# Altium schematic sheet TIDA050024.SchDoc (part 2 of 3)
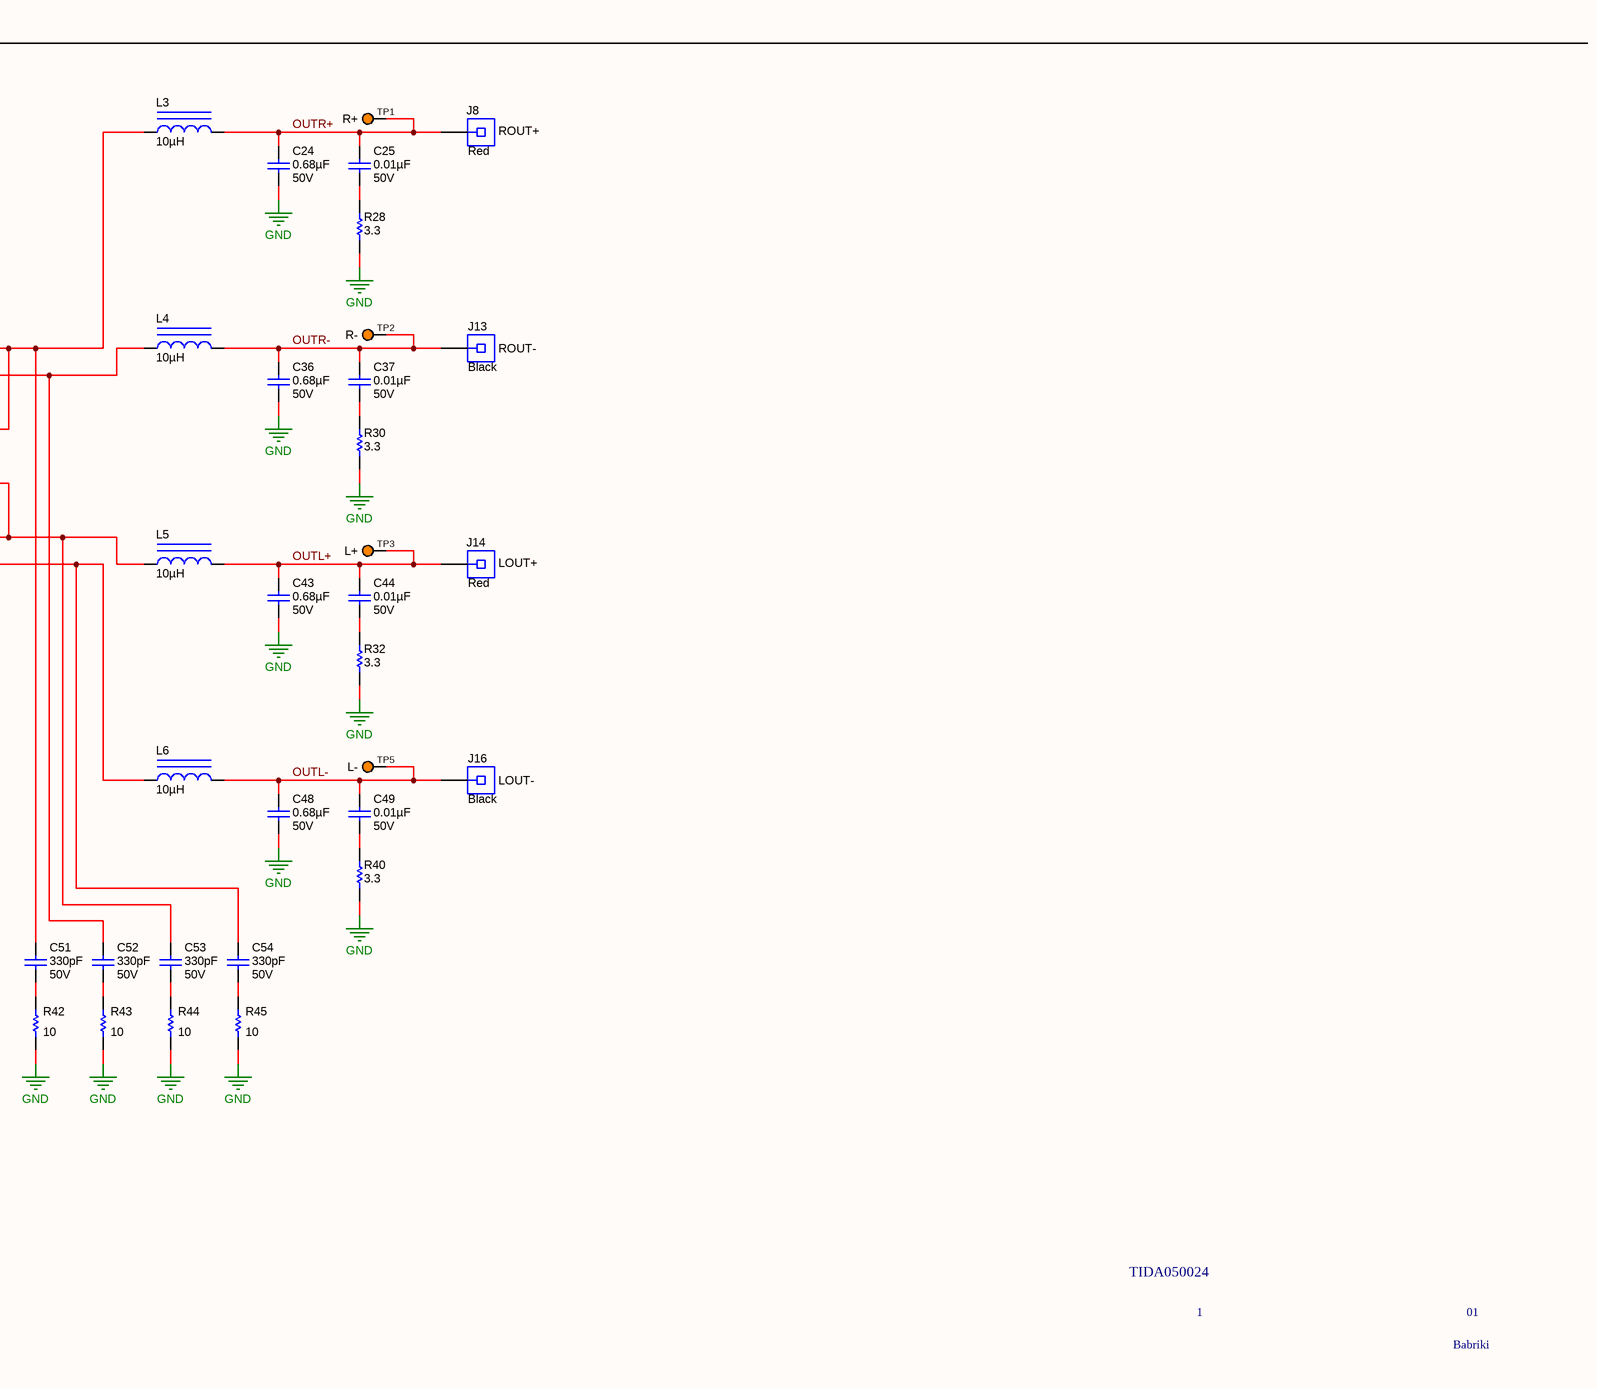
[diagram p5: TIDA050024.SchDoc, bottom right]
## Library data of the parts
C1 C2 C12 C19 C21 C23 = GRM188R61E106MA73D: CAP, CERM, 10 µF, 25 V, +/- 20%, X5R, 0603; Manufacturer: MuRata; Polarized: N; CompType: Capacitor; Value: 10uF; U/M: EA; Cap_F: 0.00001; Tolerance_%: 20; Value1: Unknown; VDC_V: 25; Value2: 25V; TaMin_C: -55; TaMax_C: 85; AEC Category: Q200; SymbolVersion: 2008-07-09; PartNumber: GRM188R61E106MA73D; PackageReference: 0603; RoHS: Y; MountType: SMT; Technology: Ceramic; TempCo: X5R; Cap_Case: 0603; Published: 2008-06-19; Publisher: Texas Instruments; LatestRevisionDate: 2016-04-09; ComponentLink1Description: Datasheet link; ComponentLink1URL: http://psearch.murata.com/capacitor/product/GRM188R61E106MA73%23.pdf; Supplier 1: Digi-Key; Supplier Part Number 1: 490-7202-1-ND; Supplier 2: Mouser; Supplier Part Number 2: 81-GRM188R61E106MA3L; Supplier 3: Farnell; Supplier Part Number 3: 1828803RL; AEC Qualified: ?
C3 = T495D476M025ATE120: CAP, TA, 47 µF, 25 V, +/- 20%, 0.12 ohm, SMD; Manufacturer: Kemet; Polarized: Y; CompType: Capacitor; Value: 47uF; U/M: EA; Cap_F: 0.000047; Tolerance_%: 20; VDC_V: 25; Value2: 25V; ESR_ohm: 0.12; IRMS_A: 1.006; TaMin_C: -55; TaMax_C: 125; Cap_Case: D; AEC Category: Q200; SymbolVersion: 2008-07-09; PartNumber: T495D476M025ATE120; PackageReference: 7343-31; RoHS: Y; Value1: 0.12 ohm; MountType: SMT; Technology: TA; Series: T495; Publisher: Texas Instruments; LatestRevisionDate: 2015-12-04; LatestRevisionNote: Updated supplier links; ComponentLink1Description: Datasheet link; ComponentLink1URL: http://www.kemet.com/kemet/web/homepage/kechome.nsf/file/T495%20Series/$file/F3102_T495.pdf; Supplier 1: Digi-Key; Supplier Part Number 1: 399-4650-1-ND; Supplier 2: Mouser; Supplier Part Number 2: 80-T495D476M025E120; Supplier 3: Farnell; Supplier Part Number 3: 1641490; AEC Qualified: ?
C4 C7-C10 C29 = GRM32ER61E226KE15L: CAP, CERM, 22 µF, 25 V, +/- 10%, X5R, 1210; Manufacturer: MuRata; Polarized: N; CompType: Capacitor; Value: 22uF; U/M: EA; Cap_F: 0.000022; Tolerance_%: 10; ESR_ohm: 0.002; Value1: 0.002 ohm; VDC_V: 25; Value2: 25V; IRMS_A: 3.67; TaMin_C: -55; TaMax_C: 85; Cap_Case: 1210; SizeArea_mm2: 8; SizeAreaWB_mm2: 14.7; SizeX_mm: 3.2; SizeY_mm: 2.5; SizeZ_mm: 2.7; AEC Category: Q200; SymbolVersion: 2008-07-09; PartNumber: GRM32ER61E226KE15L; PackageReference: 1210; RoHS: Y; MountType: SMT; Technology: Ceramic; TempCo: X5R; Published: 2008-06-19; Publisher: Texas Instruments; LatestRevisionDate: 2017-01-30; ComponentLink1Description: Datasheet link; ComponentLink1URL: http://search.murata.co.jp/Ceramy/PnsearchViewAction.do?HnOFG=ON&HnNFG=ON&SEL_CNT=50&sLang=en&sKey=GRM32ER61E226KE15L&x=9&y=9&search=startwith; Supplier 1: Mouser; Supplier Part Number 1: 81-GRM32ER61E226KE15; Supplier 2: Farnell; Supplier Part Number 2: 1828821; AEC Qualified: ?
C5 C22 = C1005X5R1E105K050BC: CAP, CERM, 1 µF, 25 V,+/- 10%, X5R, 0402; Manufacturer: TDK; Polarized: N; CompType: Capacitor; Value: 1uF; U/M: EA; Cap_F: 0.000001; Tolerance_%: 10; VDC_V: 25; Value2: 25V; TaMin_C: -55; TaMax_C: 80; SizeArea_mm2: 0.5; SizeAreaWB_mm2: 3; SizeX_mm: 1; SizeZ_mm: 0.6; AEC Category: Q200; Green_Lifecycle: Active; Green_REACh: Passed; SymbolVersion: 2008-07-09; PartNumber: C1005X5R1E105K050BC; PackageReference: 0402; RoHS: Y; MountType: SMT; Technology: Ceramic; TempCo: X5R; Cap_Case: 0402; SizeY_mm: 0.5; Published: 2008-06-19; Publisher: Texas Instruments; LatestRevisionDate: 2017-06-22; ComponentLink1Description: Datasheet link; ComponentLink1URL: https://product.tdk.com/info/en/catalog/datasheets/mlcc_commercial_general_en.pdf; Supplier 1: Digi-Key; Supplier Part Number 1: 445-9066-1-ND; Supplier 2: Newark; Supplier Part Number 2: 07W9127; Supplier 3: Mouser; Supplier Part Number 3: 810-C1005X5R1E105K; AEC Qualified: N; AEC Grade: N/A; Green_EU RoHS: Passed; Green_EU RoHS-2: Passed
C6 C15 C20 = GRM1555C1H101JA01D: CAP, CERM, 100 pF, 50 V,+/- 5%, C0G/NP0, 0402; Manufacturer: MuRata; Polarized: N; CompType: Capacitor; Value: 100pF; U/M: EA; Cap_F: 0.0000000001; Tolerance_%: 5; VDC_V: 50; Value2: 50V; TaMin_C: -55; TaMax_C: 125; SizeArea_mm2: 0.5; SizeAreaWB_mm2: 3; SizeX_mm: 1; SizeZ_mm: 0.6; AEC Category: Q200; Green_Lifecycle: Active; Green_REACh: Passed; SymbolVersion: 2008-07-09; PartNumber: GRM1555C1H101JA01D; PackageReference: 0402; RoHS: Y; MountType: SMT; Technology: Ceramic; TempCo: C0G/NP0; Cap_Case: 0402; SizeY_mm: 0.5; Published: 2008-06-19; Publisher: Texas Instruments; LatestRevisionDate: 2017-06-22; ComponentLink1Description: Datasheet link; ComponentLink1URL: http://search.murata.co.jp/Ceramy/PnsearchViewAction.do?HnOFG=ON&HnNFG=ON&SEL_CNT=50&sLang=en&sKey=GRM1555C1H101JA01D&x=9&y=9&search=startwith; Supplier 1: Mouser; Supplier Part Number 1: 81-GRM1555C1H101JA1D; AEC Qualified: ?; Green_EU RoHS: Passed; Green_EU RoHS-2: Incomplete
C11 C13 C14 C16 C18 = CGA2B3X7R1H104K050BB: CAP, CERM, 0.1 µF, 50 V,+/- 10%, X7R, AEC-Q200 Grade 1, 0402; Manufacturer: TDK; Polarized: N; CompType: Capacitor; Value: 0.1uF; U/M: EA; Cap_F: 0.0000001; Tolerance_%: 10; ESR_ohm: 0.039064; Value1: 0.039064 ohm; VDC_V: 50; Value2: 50V; IRMS_A: 0.814669; TaMin_C: -55; TaMax_C: 125; SizeArea_mm2: 0.5; SizeAreaWB_mm2: 3; SizeX_mm: 1; SizeZ_mm: 0.6; AEC Category: Q200; AEC Qualified: Y; Green_Lifecycle: Active; Green_REACh: Passed; SymbolVersion: 2008-07-09; PartNumber: CGA2B3X7R1H104K050BB; PackageReference: 0402; RoHS: Y; MountType: SMT; Technology: Ceramic; TempCo: X7R; Cap_Case: 0402; SizeY_mm: 0.5; Published: 2008-06-19; Publisher: Texas Instruments; LatestRevisionDate: 2017-06-22; ComponentLink1Description: Datasheet link; ComponentLink1URL: https://product.tdk.com/en/search/capacitor/ceramic/mlcc/info?part_no=CGA2B3X7R1H104K050BB; Supplier 1: Digi-Key; Supplier Part Number 1: 445-6899-1-ND; Supplier 2: Newark; Supplier Part Number 2: 04X3148; Supplier 3: Mouser; Supplier Part Number 3: 810-CGA2B3X7R1H104K; AEC Grade: 1; Green_EU RoHS: Passed; Green_EU RoHS-2: Passed
C17 = GCM155R71E223KA55D: CAP, CERM, 0.022 µF, 25 V,+/- 10%, X7R, AEC-Q200 Grade 1, 0402; Manufacturer: MuRata; Polarized: N; CompType: Capacitor; Value: 0.022uF; U/M: EA; Cap_F: 0.000000022; Tolerance_%: 10; VDC_V: 25; Value2: 25V; TaMin_C: -55; TaMax_C: 125; SizeArea_mm2: 0.5; SizeAreaWB_mm2: 3; SizeX_mm: 1; SizeZ_mm: 0.6; AEC Category: Q200; AEC Qualified: Y; SymbolVersion: 2008-07-09; PartNumber: GCM155R71E223KA55D; PackageReference: 0402; RoHS: Y; MountType: SMT; Technology: Ceramic; TempCo: X7R; Cap_Case: 0402; SizeY_mm: 0.5; Published: 2008-06-19; Publisher: Texas Instruments; LatestRevisionDate: 2017-06-22; ComponentLink1Description: Datasheet link; ComponentLink1URL: http://psearch.murata.com/capacitor/product/GCM155R71E223KA55%23.pdf; Supplier 1: Digi-Key; Supplier Part Number 1: 490-6044-1-ND; Supplier 2: Newark; Supplier Part Number 2: 55Y9821; Supplier 3: Mouser; Supplier Part Number 3: 81-GCM155R71E223KA5D; AEC Grade: 1
C24 C36 C43 C48 = GRM31MR71H684KA88L: CAP, CERM, 0.68 µF, 50 V, +/- 10%, X7R, 1206; Manufacturer: MuRata; Polarized: N; CompType: Capacitor; Value: 0.68uF; U/M: EA; Cap_F: 0.00000068; Tolerance_%: 10; Value1: Unknown; VDC_V: 50; TaMin_C: -55; TaMax_C: 125; Cap_Case: 1206; SymbolVersion: 2008-07-09; PartNumber: GRM31MR71H684KA88L; PackageReference: 1206; RoHS: Y; MountType: SMT; Technology: Ceramic; TempCo: X7R; Published: 2008-06-19; Publisher: Texas Instruments; LatestRevisionDate: 2014-12-30; ComponentLink1Description: Datasheet link; ComponentLink1URL: http://search.murata.co.jp/Ceramy/PnsearchViewAction.do?HnOFG=ON&HnNFG=ON&SEL_CNT=50&sLang=en&sKey=GRM31MR71H684KA88L&x=9&y=9&search=startwith; Supplier 1: Digi-Key; Supplier Part Number 1: GRM31MR71H684KA88L-ND; Supplier 2: Mouser; Supplier Part Number 2: 81-GRM31MR71H684KA8L; ClassName: LC Caps
C25 C37 C44 C49 = GRM188R71H103KA01D: CAP, CERM, 0.01 µF, 50 V, +/- 10%, X7R, 0603; Manufacturer: MuRata; Polarized: N; CompType: Capacitor; Value: 0.01uF; U/M: EA; Cap_F: 0.00000001; Tolerance_%: 10; Value1: Unknown; VDC_V: 50; TaMin_C: -55; TaMax_C: 125; Cap_Case: 0603; SymbolVersion: 2008-07-09; PartNumber: GRM188R71H103KA01D; PackageReference: 0603; RoHS: Y; MountType: SMT; Technology: Ceramic; TempCo: X7R; Published: 2008-06-19; Publisher: Texas Instruments; LatestRevisionDate: 2014-11-14; ComponentLink1Description: Datasheet link; ComponentLink1URL: http://search.murata.co.jp/Ceramy/PnsearchViewAction.do?HnOFG=ON&HnNFG=ON&SEL_CNT=50&sLang=en&sKey=GRM188R71H103KA01D&x=9&y=9&search=startwith; Supplier 1: Digi-Key; Supplier Part Number 1: 490-1512-1-ND; Supplier 2: Mouser; Supplier Part Number 2: 81-GRM39X103K50D; Supplier 3: Farnell; Supplier Part Number 3: 8819980
C26 C32 = EEU-FC1V221: CAP, AL, 220 µF, 35 V, +/- 20%, 0.09 ohm, TH; Manufacturer: Panasonic; Polarized: Y; CompType: Capacitor; Value: 220uF; U/M: EA; Cap_F: 0.00022; Tolerance_%: 20; VDC_V: 35; ESR_ohm: 0.09; IRMS_A: 0.755; TaMin_C: -55; TaMax_C: 105; Cap_Case: 10x12.5; SymbolVersion: 2008-07-09; PartNumber: EEU-FC1V221; PackageReference: 10x12.5mm; RoHS: Y; Value1: 0.09 ohm; MountType: TH; Technology: AL; Series: FC; Publisher: Texas Instruments; LatestRevisionDate: 2015-01-27; ComponentLink1Description: Datasheet link; ComponentLink1URL: http://industrial.panasonic.com/www-data/pdf/ABA0000/ABA0000CE22.pdf; Supplier 1: Digi-Key; Supplier Part Number 1: P10297-ND; Supplier 2: Mouser; Supplier Part Number 2: 667-EEU-FC1V221
C27 C33 = GCM188R71H104KA57D: CAP, CERM, 0.1 µF, 50 V, +/- 10%, X7R, 0603; Manufacturer: MuRata; Polarized: N; CompType: Capacitor; Value: 0.1uF; U/M: EA; Cap_F: 0.0000001; Tolerance_%: 10; ESR_ohm: 0.02; Value1: 0.02 ohm; VDC_V: 50; IRMS_A: 1.84; TaMin_C: -55; TaMax_C: 125; Cap_Case: 0603; SymbolVersion: 2008-07-09; PartNumber: GCM188R71H104KA57D; PackageReference: 0603; RoHS: Y; MountType: SMT; Technology: Ceramic; TempCo: X7R; Published: 2008-06-19; Publisher: Texas Instruments; LatestRevisionDate: 2014-12-30; ComponentLink1Description: Datasheet link; ComponentLink1URL: http://psearch.murata.com/capacitor/product/GCM188R71H104KA57%23.pdf; Supplier 1: Digi-Key; Supplier Part Number 1: 490-4779-1-ND; Supplier 2: Mouser; Supplier Part Number 2: 81-GCM188R71H104KA7D; ClassName: Full Flood
C28 C34 = GRM1885C1H102JA01D: CAP, CERM, 1000 pF, 50 V, +/- 5%, C0G/NP0, 0603; Manufacturer: MuRata; Polarized: N; CompType: Capacitor; Value: 1000pF; U/M: EA; Cap_F: 0.000000001; Tolerance_%: 5; Value1: Unknown; VDC_V: 50; TaMin_C: -55; TaMax_C: 125; Cap_Case: 0603; SymbolVersion: 2008-07-09; PartNumber: GRM1885C1H102JA01D; PackageReference: 0603; RoHS: Y; MountType: SMT; Technology: Ceramic; TempCo: C0G/NP0; Published: 2008-06-19; Publisher: Texas Instruments; LatestRevisionDate: 2014-12-30; ComponentLink1Description: Datasheet link; ComponentLink1URL: http://search.murata.co.jp/Ceramy/PnsearchViewAction.do?HnOFG=ON&HnNFG=ON&SEL_CNT=50&sLang=en&sKey=GRM1885C1H102JA01D&x=9&y=9&search=startwith; Supplier 1: Digi-Key; Supplier Part Number 1: 490-1451-1-ND; Supplier 2: Mouser; Supplier Part Number 2: 81-GRM39C102J50; Supplier 3: Farnell; Supplier Part Number 3: 8819920; ClassName: Full Flood
C30 C31 C35 C42 C45-C47 = GRM188R61E105KA12D: CAP, CERM, 1 µF, 25 V, +/- 10%, X5R, 0603; Manufacturer: MuRata; Polarized: N; CompType: Capacitor; Value: 1uF; U/M: EA; Cap_F: 0.000001; Tolerance_%: 10; Value1: Unknown; VDC_V: 25; Value2: 25V; TaMin_C: -55; TaMax_C: 85; SizeArea_mm2: 1.28; SizeAreaWB_mm2: 4.68; SizeX_mm: 1.6; SizeY_mm: 0.8; SizeZ_mm: 1; AEC Category: Q200; Green_Lifecycle: Active; Green_REACh: Passed; SymbolVersion: 2008-07-09; PartNumber: GRM188R61E105KA12D; PackageReference: 0603; RoHS: Y; MountType: SMT; Technology: Ceramic; TempCo: X5R; Cap_Case: 0603; Published: 2008-06-19; Publisher: Texas Instruments; LatestRevisionDate: 2017-04-28; ComponentLink1Description: Datasheet link; ComponentLink1URL: http://search.murata.co.jp/Ceramy/PnsearchViewAction.do?HnOFG=ON&HnNFG=ON&SEL_CNT=50&sLang=en&sKey=GRM188R61E105KA12D&x=9&y=9&search=startwith; Supplier 1: Digi-Key; Supplier Part Number 1: 490-3897-1-ND; Supplier 2: Mouser; Supplier Part Number 2: 81-GRM188R61E105KA12; Supplier 3: Farnell; Supplier Part Number 3: 1828802; AEC Qualified: ?; Green_EU RoHS: Passed; Green_EU RoHS-2: Incomplete
C38-C41 = GCM188R71H104KA57D: CAP, CERM, 0.1 µF, 50 V, +/- 10%, X7R, 0603; Manufacturer: MuRata; Polarized: N; CompType: Capacitor; Value: 0.1uF; U/M: EA; Cap_F: 0.0000001; Tolerance_%: 10; ESR_ohm: 0.02; Value1: 0.02 ohm; VDC_V: 50; Value2: 50V; IRMS_A: 1.84; TaMin_C: -55; TaMax_C: 125; Cap_Case: 0603; SymbolVersion: 2008-07-09; PartNumber: GCM188R71H104KA57D; PackageReference: 0603; RoHS: Y; MountType: SMT; Technology: Ceramic; TempCo: X7R; Published: 2008-06-19; Publisher: Texas Instruments; LatestRevisionDate: 2014-12-30; ComponentLink1Description: Datasheet link; ComponentLink1URL: http://psearch.murata.com/capacitor/product/GCM188R71H104KA57%23.pdf; Supplier 1: Digi-Key; Supplier Part Number 1: 490-4779-1-ND; Supplier 2: Mouser; Supplier Part Number 2: 81-GCM188R71H104KA7D; ClassName: Full Flood
C50 = GRM1885C1H470JA01D: CAP, CERM, 47 pF, 50 V, +/- 5%, C0G/NP0, 0603; Manufacturer: MuRata; Polarized: N; CompType: Capacitor; Value: 47pF; U/M: EA; Cap_F: 0.000000000047; Tolerance_%: 5; Value1: Unknown; VDC_V: 50; Value2: 50V; TaMin_C: -55; TaMax_C: 125; Cap_Case: 0603; AEC Category: Q200; SymbolVersion: 2008-07-09; PartNumber: GRM1885C1H470JA01D; PackageReference: 0603; RoHS: Y; MountType: SMT; Technology: Ceramic; TempCo: C0G/NP0; Published: 2008-06-19; Publisher: Texas Instruments; LatestRevisionDate: 2016-01-20; ComponentLink1Description: Datasheet link; ComponentLink1URL: http://search.murata.co.jp/Ceramy/PnsearchViewAction.do?HnOFG=ON&HnNFG=ON&SEL_CNT=50&sLang=en&sKey=GRM1885C1H470JA01D&x=9&y=9&search=startwith; Supplier 1: Digi-Key; Supplier Part Number 1: 490-1419-1-ND; Supplier 2: Mouser; Supplier Part Number 2: 81-GRM39C470J50; Supplier 3: Farnell; Supplier Part Number 3: 8819840; AEC Qualified: ?
C51-C54 = GRM1885C1H331JA01D: CAP, CERM, 330 pF, 50 V, +/- 5%, C0G/NP0, 0603; Manufacturer: MuRata; Polarized: N; CompType: Capacitor; Value: 330pF; U/M: EA; Cap_F: 0.00000000033; Tolerance_%: 5; Value1: Unknown; VDC_V: 50; TaMin_C: -55; TaMax_C: 125; Cap_Case: 0603; SymbolVersion: 2008-07-09; PartNumber: GRM1885C1H331JA01D; PackageReference: 0603; RoHS: Y; MountType: SMT; Technology: Ceramic; TempCo: C0G/NP0; Published: 2008-06-19; Publisher: Texas Instruments; LatestRevisionDate: 2014-12-30; ComponentLink1Description: Datasheet link; ComponentLink1URL: http://search.murata.co.jp/Ceramy/PnsearchViewAction.do?HnOFG=ON&HnNFG=ON&SEL_CNT=50&sLang=en&sKey=GRM1885C1H331JA01D&x=9&y=9&search=startwith; Supplier 1: Digi-Key; Supplier Part Number 1: 490-1439-1-ND; Supplier 2: Mouser; Supplier Part Number 2: 81-GRM39C331J50; Supplier 3: Farnell; Supplier Part Number 3: 8819890
D1 = BZX84C4V3LT1G: Diode, Zener, 4.3 V, 225 mW, SOT-23; Manufacturer: ON Semiconductor; U/M: EA; Power_W: 0.225; Vz_V: 4.3; Value1: 0.225W; RJA_CperW: 556; SizeAreaWB_mm2: 14; SizeArea_mm2: 7.5; SizeX_mm: 2.5; SizeY_mm: 3; SizeZ_mm: 1.1; AEC Category: Q101; CompType: Zener; SymbolVersion: 2010-08-25; PartNumber: BZX84C4V3LT1G; MountType: SMT; RoHS: Y; PackageReference: SOT-23; Vr_V: N/A; ComponentLink1Description: Datasheet link; ComponentLink1URL: http://www.onsemi.com/pub_link/Collateral/BZX84C2V4LT1-D.PDF; Published: 2008-10-08; Publisher: Texas Instruments; LatestRevisionDate: 2016-12-06; LatestRevisionNote: Updated Supplier Data; Supplier 1: Digi-Key; Supplier Part Number 1: BZX84C4V3LT1GOSCT-ND; Supplier 2: Mouser; Supplier Part Number 2: 863-BZX84C4V3LT1G; Supplier 3: Farnell; Supplier Part Number 3: 1150381; AEC Qualified: ?
D2-D4 = 1N4148WT: Diode, Switching, 75 V, 0.3 A, SMD, 2-Leads, Body 1.2x0.8mm; Manufacturer: Fairchild Semiconductor; U/M: EA; Value: 75V; Value1: 0.3A; Io_A: 0.3; Vr_V: 75; TJmax_C: 150; SymbolVersion: 2008-12-08; PartNumber: 1N4148WT; PackageReference: SMD, 2-Leads, Body 1.2x0.8mm; CompType: Diode; Value2: V; MountType: SMT; Type: Switching; RoHS: Y; Published: 2008-06-26; Publisher: Texas Instruments; LatestRevisionDate: 2015-06-17; ComponentLink1Description: Datasheet link; ComponentLink1URL: https://www.fairchildsemi.com/datasheets/1N/1N914BWT.pdf; Supplier 1: Digi-Key; Supplier Part Number 1: 1N4148WTCT-ND; Supplier 2: Mouser; Supplier Part Number 2: 512-1N4148WT
H1 = ATS-TI10P-521-C1-R1: Heatsink FOR TI MOD, 50x13.9mm; Manufacturer: Advanced Thermal Solutions; SymbolCreator: a0799628; SymbolVersion: 2013-12-05; CompType: Heatsink; PartNumber: ATS-TI10P-521-C1-R1; RoHS: Y; PackageReference: HEAT SINK, 50x13.9mm; MountType: N/A; ComponentLink1Description: Datasheet Link; ComponentLink1URL: https://sps06.itg.ti.com/sites/KMS/crossdivteams/altium/docs/ComponentDatasheets/ATS-TI10P-521-C1-R1.pdf; Publisher: Texas Instruments; LatestRevisionDate: 2017-06-22
J1-J3 J5 = CMP-0055113-1: Terminal, Turret, TH, Double; Manufacturer: Keystone; CT: FALSE; Green_REACh: Passed; CompType: Turret Terminal; Green_Lifecycle: Active; ComponentLink1URL: http://www.keyelco.com/pdfs/M55p126.pdf; Publisher: Texas Instruments; Green_EU RoHS-2: Passed; Supplier 1: Digi-Key; PackageReference: Keystone1502-2; LatestRevisionDate: 26/05/2017; RoHS: Y; CNHeader: FALSE; Supplier Part Number 1: 36-1502-2-ND; MountType: TH; Green_EU RoHS: Passed with Exemption; PartNumber: 1502-2; ComponentLink1Description: Datasheet URL
J4 J6 J17 = TSW-103-07-G-S: Header, 100mil, 3x1, Gold, TH; Manufacturer: Samtec; SymbolCreator: a0799628; U/M: EA; SymbolVersion: 2013-03-28; PartNumber: TSW-103-07-G-S; PackageReference: 3x1 Header; ClassName: Header; CompType: Header; RoHS: Y; MountType: TH; ComponentLink1Description: Datasheet Link; ComponentLink1URL: http://samtec.com/ftppub/pdf/TSW_TH.PDF; Publisher: Texas Instruments; LatestRevisionDate: 2015-10-02; Supplier 1: Digi-Key; Supplier Part Number 1: SAM1029-03-ND
J7 J10 JP1-JP3 = TSW-102-07-G-S: Header, 100mil, 2x1, Gold, TH; Manufacturer: Samtec; SymbolCreator: a0412235; Pitch_mm: 2.54; Gender: Male; Shrouded: N; Row_Count: 1; Current_A: 6.3; Voltage_V: 550; Cert_CSA: Y; SymbolVersion: 2013-10-31; PartNumber: TSW-102-07-G-S; PackageReference: 2x1 Header; ClassName: Header; CompType: Header; RoHS: Y; MountType: TH; ComponentLink1Description: Datasheet URL; ComponentLink1URL: http://samtec.com/ftppub/pdf/TSW_TH.PDF; Orientation: Vertical; PinCount: 2; ContactFinish: Gold; Color: Black; Cert_UL: Y; Cert_CULUS: N; Cert_VDE: N; Publisher: Texas Instruments; LatestRevisionDate: 2016-12-09; Supplier 1: Digi-Key; Supplier Part Number 1: SAM1029-02-ND
J8 J14 = 7006: Binding Post, RED, TH; Manufacturer: Keystone; SymbolCreator: a0799628; CompType: Connector; U/M: EA; SymbolVersion: 2014-1-06; PartNumber: 7006; PackageReference: 11.4x27.2mm; RoHS: Y; MountType: TH; ComponentLink1Description: Datasheet Link; ComponentLink1URL: http://www.keyelco.com/product-pdf.cfm?p=2394; Publisher: Texas Instruments; LatestRevisionDate: 2014-11-04; Supplier 1: Digi-Key; Supplier Part Number 1: 7006K-ND; Supplier 2: Mouser; Supplier Part Number 2: 534-7006; Supplier 3: Farnell; Supplier Part Number 3: 1711281
J9 = PBC03SAAN: Header, 100mil, 3x1, Gold, TH; Manufacturer: Sullins Connector Solutions; SymbolVersion: 2008-06-30; PartNumber: PBC03SAAN; PackageReference: PBC03SAAN; ClassName: Header; CompType: Header; RoHS: Y; MountType: TH; ComponentLink1Description: Datasheet URL; ComponentLink1URL: http://www.sullinscorp.com/catalogs/77_Page78-79_HEADER_.100_2.54mm_MALE_BREAKAWAY.pdf; Publisher: Texas Instruments; LatestRevisionDate: 2016-02-23; Supplier 1: Digi-Key; Supplier Part Number 1: S1011E-03-ND
J11 = 1502-2: Terminal, Turret, TH, Double; Manufacturer: Keystone; CompType: Turret Terminal; U/M: EA; SymbolVersion: 2010-10-20; PartNumber: 1502-2; PackageReference: Keystone1502-2; RoHS: Y; MountType: TH; ComponentLink1Description: Datasheet Link; ComponentLink1URL: http://www.keyelco.com/pdfs/M55p126.pdf; Value: Double; Publisher: Texas Instruments; LatestRevisionDate: 2015-05-13; Supplier 1: Digi-Key; Supplier Part Number 1: 1502-2K-ND
J12 = 971: RCA Jack, Red, R/A, TH; Manufacturer: Keystone; SymbolCreator: Altium; CompType: Phono Jack; U/M: EA; SymbolVersion: 2014-11-24; PartNumber: 971; PackageReference: PC Mount Phono Jack-Red, TH; RoHS: Y; MountType: TH; ComponentLink1Description: Datasheet Link; ComponentLink1URL: http://www.keyelco.com/product-pdf.cfm?p=3125; Publisher: Texas Instruments; LatestRevisionDate: 2014-12-03; Supplier 1: Digi-Key; Supplier Part Number 1: KEY1099-ND; Supplier 2: Mouser; Supplier Part Number 2: 534-971
J13 J16 = 7007: Binding Post, BLACK, TH; Manufacturer: Keystone; SymbolCreator: a0799628; CompType: Connector; U/M: EA; SymbolVersion: 2014-1-06; PartNumber: 7007; PackageReference: 11.4x27.2mm; RoHS: Y; MountType: TH; ComponentLink1Description: Datasheet Link; ComponentLink1URL: http://www.keyelco.com/product-pdf.cfm?p=2394; Publisher: Texas Instruments; LatestRevisionDate: 2014-11-04; Supplier 1: Digi-Key; Supplier Part Number 1: 7007K-ND; Supplier 2: Mouser; Supplier Part Number 2: 534-7007; Supplier 3: Newark; Supplier Part Number 3: 96B2542
J15 = 970: RCA Jack, White, R/A, TH; Manufacturer: Keystone; SymbolCreator: Altium; CompType: Phono Jack; U/M: EA; SymbolVersion: 2014-11-26; PartNumber: 970; PackageReference: PC Mount Phono Jack-White, TH; RoHS: Y; MountType: TH; ComponentLink1Description: Datasheet Link; ComponentLink1URL: http://www.keyelco.com/product-pdf.cfm?p=3125; Publisher: Texas Instruments; LatestRevisionDate: 2014-12-03; Supplier 1: Digi-Key; Supplier Part Number 1: KEY1098-ND; Supplier 2: Mouser; Supplier Part Number 2: 534-970
L1 = DFE252012F-2R2M=P2: Inductor, Shielded, Powdered Iron, 2.2 µH, 2.3 A, 0.082 ohm, SMD; Manufacturer: MuRata Toko; Value: 2.2uH; Ind_H: 2.2E-6; Imax_A: 2.3; Irms: 2.3A @ 40C rise; Isat: 3.3A @ 30% inductance drop; DCR_ohm: 0.082; Value2: 2.3A; SizeAreaWB_mm2: 11.84; SizeArea_mm2: 5.94; SizeX_mm: 2.7; SizeY_mm: 2.2; SizeZ_mm: 1.2; AEC Category: Q200; AEC Qualified: N; SymbolVersion: 2008-07-23; CompType: Inductor; PartNumber: DFE252012F-2R2M=P2; Value1: 0.082 ohm; Technology: Shielded; MountType: SMT; Material: Powdered Iron; PackageReference: 2.5x1.2x2mm; Published: 2008-06-26; Publisher: Texas Instruments; LatestRevisionDate: 2017-03-16; ComponentLink1Description: Datasheet link; ComponentLink1URL: http://www.toko.co.jp/products-murata/pdf/inductors/m_dfe252012f.pdf; RoHS: Y; Supplier 1: Digi-Key; Supplier Part Number 1: 490-13055-1-ND; Supplier 2: Mouser; Supplier Part Number 2: 81-DFE252012F-2R2MP2; AEC Grade: N/A
L2 = XAL1350-302MEB: Inductor, Shielded, Composite, 3 µH, 21 A, 0.0059 ohm, SMD; Manufacturer: Coilcraft; Value: 3uH; Ind_H: 3.0E-6; Imax_A: 21; Irms: 21A @ 40C rise; Isat: 37A @ 30% inductance drop; DCR_ohm: 0.0059; Value2: 21A; SizeAreaWB_mm2: 240; SizeArea_mm2: 182; SizeX_mm: 13; SizeY_mm: 14; SizeZ_mm: 5; AEC Category: Q200; AEC Qualified: N; SymbolVersion: 2008-07-23; CompType: Inductor; PartNumber: XAL1350-302MEB; Value1: 0.0059 ohm; Technology: Shielded; MountType: SMT; Material: Composite; PackageReference: 13x14mm; Published: 2008-06-26; Publisher: Texas Instruments; LatestRevisionDate: 2017-05-12; ComponentLink1Description: Datasheet link; ComponentLink1URL: http://www.coilcraft.com/pdfs/xal1350.pdf; RoHS: Y; AEC Grade: N/A
L3-L6 = SRT8045-103MEB: Inductor, Shielded, Ferrite, 10 µH, 4.2 A, 0.037 ohm, AEC-Q200 Grade 1, SMD; Manufacturer: Coilcraft; Value: 10uH; Ind_H: 10.0E-6; Imax_A: 4.2; Irms: 4.2A @ 20C rise; Isat: 5.7A @ 10% inductance drop; DCR_ohm: 0.037; Value2: 4.2A; SizeAreaWB_mm2: 104; SizeArea_mm2: 67.2; SizeX_mm: 8; SizeY_mm: 8.4; SizeZ_mm: 4.6; AEC Category: Q200; AEC Qualified: Y; AEC Grade: 1; SymbolVersion: 2008-07-23; CompType: Inductor; PartNumber: SRT8045-103MEB; Value1: 0.037 ohm; Technology: Shielded; MountType: SMT; Material: Ferrite; PackageReference: 8x8.4mm; Published: 2008-06-26; Publisher: Texas Instruments; LatestRevisionDate: 2017-05-12; ComponentLink1Description: Datasheet link; ComponentLink1URL: http://www.coilcraft.com/pdfs/SRT8045.pdf; RoHS: Y
Q1 = CSD87351Q5D: MOSFET, 2-CH, N-CH, 30 V, 35 A, DQY0008A (LSON-CLIP-8); Manufacturer: Texas Instruments; Alternate Manufacturer: None; SymbolCreator: a0799628; U/M: EA; ChType: N; Value: 30V; VdsMax_V: 30; Value1: 0.0088 ohm; Rdson45_ohm: 0.0088; Value2: 5.9 nC; QgTyp_nC: 5.9; Vgs_V: 10; IdsMax_A: 35; SizeAreaWB_mm2: 56; SizeX_mm: 6; SizeY_mm: 5; SizeZ_mm: 1.6; AEC Category: Q101; SymbolVersion: 2016-08-18; PartNumber: CSD87351Q5D; PackageReference: DQY0008A; CompType: MOSFET; SizeArea_mm2: 30; RoHS: Y; MountType: SMT; Published: 2008-06-19; Publisher: Texas Instruments; LatestRevisionDate: 2017-06-26; LatestRevisionNote: Added parts.; ComponentLink1Description: Datasheet link; ComponentLink1URL: http://www.ti.com/lit/ds/symlink/csd87351q5d.pdf; Supplier 1: Digi-Key; Supplier Part Number 1: 296-28327-6-ND; Supplier 2: Mouser; Supplier Part Number 2: 595-CSD87351Q5D; AEC Qualified: N
Q2 Q4 = BC850CLT1G, ON Semiconductor: Transistor, NPN, 45 V, 0.1 A, SOT-23; CompType: BJT; PNP: 0; NPN: 1; Vceo_V: 45; Vcesat1_V: 0.7; Value: 45 V; IcRated_A: 0.1; Value1: 0.1 A; HfeMax: 800; TaMin_C: -55; TaMax_C: 150; U/M: EA; SymbolVersion: 2008-07-31; PartNumber: BC850CLT1G; Manufacturer: ON Semiconductor; PackageReference: SOT-23; RoHS: Y; Value2: 800; Published: 2008-07-31; LatestRevisionDate: 2014-10-24; Publisher: Texas Instruments; ComponentLink1Description: Datasheet link; ComponentLink1URL: http://www.onsemi.com/pub_link/Collateral/BC846ALT1-D.PDF; Supplier 1: Digi-Key; Supplier Part Number 1: BC850CLT1GOSCT-ND; Supplier 2: Farnell; Supplier Part Number 2: 1278476; MountType: SMT
Q3 = BSS138: MOSFET, N-CH, 50 V, 0.22 A, SOT-23; Manufacturer: Fairchild Semiconductor; Alternate Manufacturer: None; U/M: EA; ChType: N; Value: 50V; VdsMax_V: 50; Value1: 6 ohm; Rdson45_ohm: 6; Value2: 1.7 nC; QgTyp_nC: 1.7; Vgs_V: 20; IdsMax_A: 0.22; SymbolVersion: 2008-07-28; CompType: MOSFET; PartNumber: BSS138; PackageReference: SOT-23; RoHS: Y; MountType: SMT; Published: 2008-06-19; Publisher: Texas Instruments; LatestRevisionDate: 2015-06-17; LatestRevisionNote: Added parts.; ComponentLink1Description: Datasheet link; ComponentLink1URL: http://www.fairchildsemi.com/ds/BS/BSS138.pdf; Supplier 1: Digi-Key; Supplier Part Number 1: BSS138CT-ND; Supplier 2: Mouser; Supplier Part Number 2: 512-BSS138; Supplier 3: Farnell; Supplier Part Number 3: 9845330
R1 = CSNL2512FT2L00: RES, 0.002, 1%, 2 W, 2512; Manufacturer: Stackpole Electronics Inc; CompType: Resistor; Value: 0.002; Value_Code: 2L000; Tolerance_%: 1; Power_W: 2; Value2: 2W; VDC_V: 200; TempCo: 50 ppm/C; SizeArea_mm2: 20.16; SizeX_mm: 6.3; SizeY_mm: 3.2; SizeZ_mm: 0.71; U/M: EA; AEC Category: Q200; SymbolVersion: 2009-05-29; PartNumber: CSNL2512FT2L00; PackageReference: 2512; RoHS: Y; Res_ohm: 0.002; Value1: 1%; MountType: SMT; Technology: Metal Element; Published: 2008-06-26; Publisher: Texas Instruments; LatestRevisionDate: 2017-06-26; ComponentLink1Description: Datasheet link; ComponentLink1URL: http://www.seielect.com/catalog/SEI-CSNL.pdf; Supplier 1: Digi-Key; Supplier Part Number 1: CSNL2512FT2L00CT-ND; AEC Qualified: ?
R2 R3 R5 R7 = CRCW040210R0FKED: RES, 10.0, 1%, 0.063 W, 0402; Manufacturer: Vishay-Dale; CompType: Resistor; Value: 10.0; Res_ohm: 10; Value_Code: 10R0; Tolerance_%: 1; Power_W: 0.063; Value2: 0.063W; VDC_V: 50; TempCo: 100 ppm/C; SizeArea_mm2: 0.5; SizeZ_mm: 0.6; EIA_Code: E96; U/M: EA; AEC Category: Q200; Green_Lifecycle: Active; Green_REACh: Passed; SymbolVersion: 2009-05-29; PartNumber: CRCW040210R0FKED; PackageReference: 0402; RoHS: Y; Value1: 1%; MountType: SMT; Technology: Thick Film; SizeX_mm: 1; SizeY_mm: 0.5; Published: 2008-06-26; Publisher: Texas Instruments; LatestRevisionDate: 2017-06-12; ComponentLink1Description: Datasheet link; ComponentLink1URL: http://www.vishay.com/docs/20035/dcrcwe3.pdf; Supplier 1: Digi-Key; Supplier Part Number 1: 541-10.0LCT-ND; Supplier 2: Newark; Supplier Part Number 2: 52K6600; Supplier 3: Mouser; Supplier Part Number 3: 71-CRCW0402-10-E3; AEC Qualified: ?; Green_EU RoHS: Passed with Exemption; Green_EU RoHS-2: Passed
R4 = CRCW040249R9FKED: RES, 49.9, 1%, 0.063 W, 0402; Manufacturer: Vishay-Dale; CompType: Resistor; Value: 49.9; Value_Code: 49R9; Tolerance_%: 1; Power_W: 0.063; Value2: 0.063W; VDC_V: 50; TempCo: 100 ppm/C; SizeArea_mm2: 0.5; SizeZ_mm: 0.6; EIA_Code: E96; U/M: EA; AEC Category: Q200; Green_Lifecycle: Active; Green_REACh: Passed; SymbolVersion: 2009-05-29; PartNumber: CRCW040249R9FKED; PackageReference: 0402; RoHS: Y; Res_ohm: 49.9; Value1: 1%; MountType: SMT; Technology: Thick Film; SizeX_mm: 1; SizeY_mm: 0.5; Published: 2008-06-26; Publisher: Texas Instruments; LatestRevisionDate: 2017-06-12; ComponentLink1Description: Datasheet link; ComponentLink1URL: http://www.vishay.com/docs/20035/dcrcwe3.pdf; Supplier 1: Digi-Key; Supplier Part Number 1: 541-49.9LCT-ND; Supplier 2: Newark; Supplier Part Number 2: 52K7114; Supplier 3: Mouser; Supplier Part Number 3: 71-CRCW0402-49.9-E3; AEC Qualified: ?; Green_EU RoHS: Passed with Exemption; Green_EU RoHS-2: Passed
R6 = CRCW0402196KFKED: RES, 196 k, 1%, 0.063 W, 0402; Manufacturer: Vishay-Dale; CompType: Resistor; Value: 196k; Res_ohm: 196000; Tolerance_%: 1; Power_W: 0.063; Value2: 0.063W; VDC_V: 50; TempCo: 100 ppm/C; SizeArea_mm2: 0.5; SizeZ_mm: 0.6; EIA_Code: E96; U/M: EA; AEC Category: Q200; Green_Lifecycle: Active; Green_REACh: Passed; SymbolVersion: 2009-05-29; PartNumber: CRCW0402196KFKED; PackageReference: 0402; RoHS: Y; Value_Code: 196k; Value1: 1%; MountType: SMT; Technology: Thick Film; SizeX_mm: 1; SizeY_mm: 0.5; Published: 2008-06-26; Publisher: Texas Instruments; LatestRevisionDate: 2017-06-12; ComponentLink1Description: Datasheet link; ComponentLink1URL: http://www.vishay.com/docs/20035/dcrcwe3.pdf; Supplier 1: Digi-Key; Supplier Part Number 1: 541-196KLCT-ND; Supplier 2: Newark; Supplier Part Number 2: 52K6784; Supplier 3: Mouser; Supplier Part Number 3: 71-CRCW0402-196K-E3; AEC Qualified: ?; Green_EU RoHS: Passed with Exemption; Green_EU RoHS-2: Passed
R8 = CRCW0402100KFKED: RES, 100 k, 1%, 0.063 W, 0402; Manufacturer: Vishay-Dale; CompType: Resistor; Value: 100k; Res_ohm: 100000; Tolerance_%: 1; Power_W: 0.063; Value2: 0.063W; VDC_V: 50; TempCo: 100 ppm/C; SizeArea_mm2: 0.5; SizeZ_mm: 0.6; EIA_Code: E96; U/M: EA; AEC Category: Q200; Green_Lifecycle: Active; Green_REACh: Passed; SymbolVersion: 2009-05-29; PartNumber: CRCW0402100KFKED; PackageReference: 0402; RoHS: Y; Value_Code: 100k; Value1: 1%; MountType: SMT; Technology: Thick Film; SizeX_mm: 1; SizeY_mm: 0.5; Published: 2008-06-26; Publisher: Texas Instruments; LatestRevisionDate: 2017-06-12; ComponentLink1Description: Datasheet link; ComponentLink1URL: http://www.vishay.com/docs/20035/dcrcwe3.pdf; Supplier 1: Digi-Key; Supplier Part Number 1: 541-100KLCT-ND; Supplier 2: Newark; Supplier Part Number 2: 52K6607; Supplier 3: Mouser; Supplier Part Number 3: 71-CRCW0402-100K-E3; AEC Qualified: ?; Green_EU RoHS: Passed with Exemption; Green_EU RoHS-2: Passed
R9 = CMP-0081973-1: RES, 0, 0%, 0.25 W, AEC-Q200 Grade 0, 0603; Manufacturer: Vishay-Dale; SizeAreaWB_mm2: 4.68; SizeArea_mm2: 1.28; AEC Qualified: Y; AEC Category: Q200; Value: 0; SizeZ_mm: 1; SizeY_mm: 0.8; Power_W: 250mW; Value2: 0.25W; CompType: Resistor; SizeX_mm: 1.6; ComponentLink1Description: Datasheet link; RoHS: Y; Tolerance_%: 0%; Value_Code: 0; Supplier 1: Digi-Key; PackageReference: 0603; Technology: Thick Film; Res_ohm: 0; PartNumber: RCS06030000Z0EA; Supplier Part Number 2: 71-RCS06030000Z0EA; Supplier 2: Mouser; AEC Grade: 0; ComponentLink1URL: http://www.vishay.com/docs/20065/rcse3.pdf; Value1: 0%; MountType: SMT; Supplier Part Number 1: 541-2779-1-ND
R10 = CRCW040256K2FKED: RES, 56.2 k, 1%, 0.063 W, 0402; Manufacturer: Vishay-Dale; CompType: Resistor; Value: 56.2k; Res_ohm: 56200; Value_Code: 56k2; Tolerance_%: 1; Power_W: 0.063; Value2: 0.063W; VDC_V: 50; TempCo: 100 ppm/C; SizeArea_mm2: 0.5; SizeZ_mm: 0.6; EIA_Code: E96; U/M: EA; AEC Category: Q200; Green_Lifecycle: Active; Green_REACh: Passed; SymbolVersion: 2009-05-29; PartNumber: CRCW040256K2FKED; PackageReference: 0402; RoHS: Y; Value1: 1%; MountType: SMT; Technology: Thick Film; SizeX_mm: 1; SizeY_mm: 0.5; Published: 2008-06-26; Publisher: Texas Instruments; LatestRevisionDate: 2017-06-12; ComponentLink1Description: Datasheet link; ComponentLink1URL: http://www.vishay.com/docs/20035/dcrcwe3.pdf; Supplier 1: Digi-Key; Supplier Part Number 1: 541-56.2KLCT-ND; Supplier 2: Newark; Supplier Part Number 2: 52K7159; Supplier 3: Mouser; Supplier Part Number 3: 71-CRCW0402-56.2K-E3; AEC Qualified: ?; Green_EU RoHS: Passed with Exemption; Green_EU RoHS-2: Passed
R11 = CMP-0081973-1: RES, 0, 0%, 0.25 W, AEC-Q200 Grade 0, 0603; Manufacturer: Vishay-Dale; SizeAreaWB_mm2: 4.68; SizeArea_mm2: 1.28; AEC Qualified: Y; AEC Category: Q200; Value: 0; SizeZ_mm: 1; SizeY_mm: 0.8; Power_W: 250mW; Value2: 0.25W; SizeX_mm: 1.6; ComponentLink1Description: Datasheet link; RoHS: Y; Tolerance_%: 0%; Value_Code: 0; Supplier 1: Digi-Key; PackageReference: 0603; Technology: Thick Film; Res_ohm: 0; PartNumber: RCS06030000Z0EA; Supplier Part Number 2: 71-RCS06030000Z0EA; Supplier 2: Mouser; AEC Grade: 0; ComponentLink1URL: http://www.vishay.com/docs/20065/rcse3.pdf; Value1: 0%; CompType: Resistor; MountType: SMT; Supplier Part Number 1: 541-2779-1-ND
R12 = CRCW04027K50FKED: RES, 7.50 k, 1%, 0.063 W, 0402; Manufacturer: Vishay-Dale; CompType: Resistor; Value: 7.50k; Res_ohm: 7500; Value_Code: 7k50; Tolerance_%: 1; Power_W: 0.063; Value2: 0.063W; VDC_V: 50; TempCo: 100 ppm/C; SizeArea_mm2: 0.5; SizeZ_mm: 0.6; EIA_Code: E96; U/M: EA; AEC Category: Q200; Green_Lifecycle: Active; Green_REACh: Passed; SymbolVersion: 2009-05-29; PartNumber: CRCW04027K50FKED; PackageReference: 0402; RoHS: Y; Value1: 1%; MountType: SMT; Technology: Thick Film; SizeX_mm: 1; SizeY_mm: 0.5; Published: 2008-06-26; Publisher: Texas Instruments; LatestRevisionDate: 2017-06-12; ComponentLink1Description: Datasheet link; ComponentLink1URL: http://www.vishay.com/docs/20035/dcrcwe3.pdf; Supplier 1: Digi-Key; Supplier Part Number 1: 541-7.50KLCT-ND; Supplier 2: Newark; Supplier Part Number 2: 52K7245; Supplier 3: Mouser; Supplier Part Number 3: 71-CRCW0402-7.5K-E3; AEC Qualified: ?; Green_EU RoHS: Passed with Exemption; Green_EU RoHS-2: Passed
R13 = CRCW0402137KFKED: RES, 137 k, 1%, 0.063 W, 0402; Manufacturer: Vishay-Dale; CompType: Resistor; Value: 137k; Res_ohm: 137000; Tolerance_%: 1; Power_W: 0.063; Value2: 0.063W; VDC_V: 50; TempCo: 100 ppm/C; SizeArea_mm2: 0.5; SizeZ_mm: 0.6; EIA_Code: E96; U/M: EA; AEC Category: Q200; Green_Lifecycle: Active; Green_REACh: Passed; SymbolVersion: 2009-05-29; PartNumber: CRCW0402137KFKED; PackageReference: 0402; RoHS: Y; Value_Code: 137k; Value1: 1%; MountType: SMT; Technology: Thick Film; SizeX_mm: 1; SizeY_mm: 0.5; Published: 2008-06-26; Publisher: Texas Instruments; LatestRevisionDate: 2017-06-12; ComponentLink1Description: Datasheet link; ComponentLink1URL: http://www.vishay.com/docs/20035/dcrcwe3.pdf; Supplier 1: Digi-Key; Supplier Part Number 1: 541-137KLCT-ND; Supplier 2: Newark; Supplier Part Number 2: 52K6684; Supplier 3: Mouser; Supplier Part Number 3: 71-CRCW0402-137K-E3; AEC Qualified: ?; Green_EU RoHS: Passed with Exemption; Green_EU RoHS-2: Passed
R14 = CRCW04023K01FKED: RES, 3.01 k, 1%, 0.063 W, 0402; Manufacturer: Vishay-Dale; CompType: Resistor; Value: 3.01k; Res_ohm: 3010; Value_Code: 3k01; Tolerance_%: 1; Power_W: 0.063; Value2: 0.063W; VDC_V: 50; TempCo: 100 ppm/C; SizeArea_mm2: 0.5; SizeZ_mm: 0.6; EIA_Code: E96; U/M: EA; AEC Category: Q200; SymbolVersion: 2009-05-29; PartNumber: CRCW04023K01FKED; PackageReference: 0402; RoHS: Y; Value1: 1%; MountType: SMT; Technology: Thick Film; SizeX_mm: 1; SizeY_mm: 0.5; Published: 2008-06-26; Publisher: Texas Instruments; LatestRevisionDate: 2017-01-28; ComponentLink1Description: Datasheet link; ComponentLink1URL: http://www.vishay.com/docs/20035/dcrcwe3.pdf; Supplier 1: Digi-Key; Supplier Part Number 1: 541-3.01KLCT-ND; Supplier 2: Newark; Supplier Part Number 2: 52K6935; Supplier 3: Mouser; Supplier Part Number 3: 71-CRCW0402-3.01K-E3; AEC Qualified: ?
R15 R16 R24 R25 = CRCW040210K2FKED: RES, 10.2 k, 1%, 0.063 W, 0402; Manufacturer: Vishay-Dale; CompType: Resistor; Value: 10.2k; Res_ohm: 10200; Value_Code: 10k2; Tolerance_%: 1; Power_W: 0.063; Value2: 0.063W; VDC_V: 50; TempCo: 100 ppm/C; EIA_Code: E96; U/M: EA; SymbolVersion: 2009-05-29; PartNumber: CRCW040210K2FKED; PackageReference: 0402; RoHS: Y; Value1: 1%; MountType: SMT; Technology: Thick Film; Published: 2008-06-26; Publisher: Texas Instruments; LatestRevisionDate: 2015-06-17; ComponentLink1Description: Datasheet link; ComponentLink1URL: http://www.vishay.com/docs/20035/dcrcwe3.pdf; Supplier 1: Digi-Key; Supplier Part Number 1: 541-10.2KLCT-ND; Supplier 2: Mouser; Supplier Part Number 2: 71-CRCW0402-10.2K-E3; Supplier 3: Farnell; Supplier Part Number 3: 1158295
R17 = CRCW060310K5FKEA: RES, 10.5 k, 1%, 0.1 W, 0603; Manufacturer: Vishay-Dale; CompType: Resistor; Value: 10.5k; Res_ohm: 10500; Value_Code: 10k5; Tolerance_%: 1; Power_W: 0.1; Value2: 0.1W; VDC_V: 75; TempCo: 100 ppm/C; SizeArea_mm2: 1.28; SizeX_mm: 1.6; SizeY_mm: 0.8; EIA_Code: E96; U/M: EA; AEC Category: Q200; Green_Lifecycle: Active; Green_REACh: Passed; SymbolVersion: 2009-05-29; PartNumber: CRCW060310K5FKEA; PackageReference: 0603; RoHS: Y; Value1: 1%; MountType: SMT; Technology: Thick Film; SizeZ_mm: 1; Published: 2008-06-26; Publisher: Texas Instruments; LatestRevisionDate: 2017-06-13; ComponentLink1Description: Datasheet link; ComponentLink1URL: http://www.vishay.com/docs/20035/dcrcwe3.pdf; Supplier 1: Digi-Key; Supplier Part Number 1: 541-10.5KHCT-ND; Supplier 2: Newark; Supplier Part Number 2: 52K8068; Supplier 3: Mouser; Supplier Part Number 3: 71-CRCW0603-10.5K-E3; AEC Qualified: ?; Green_EU RoHS: Passed with Exemption; Green_EU RoHS-2: Passed
R18 R22 R29 = CRCW0402100KDHEDP: RES, 100 k, 0.5%, 0.063 W, 0402; Manufacturer: Vishay-Dale; CompType: Resistor; Value: 100k; Res_ohm: 100000; Tolerance_%: 0.5; Power_W: 0.063; Value2: 0.063W; VDC_V: 50; TempCo: 50 ppm/C; EIA_Code: E192; U/M: EA; SymbolVersion: 2009-05-29; PartNumber: CRCW0402100KDHEDP; PackageReference: 0402; RoHS: Y; Value_Code: 100k; Value1: 0.5%; MountType: SMT; Technology: Thick Film; Published: 2008-06-26; Publisher: Texas Instruments; LatestRevisionDate: 2015-06-17; ComponentLink1Description: Datasheet link; ComponentLink1URL: http://www.vishay.com/docs/20036/dcrcwpe3.pdf; Supplier 1: Digi-Key; Supplier Part Number 1: 541-100KAVCT-ND
R19 R21 R27 = CRCW04020000Z0ED: RES, 0, 5%, 0.063 W, 0402; Manufacturer: Vishay-Dale; CompType: Resistor; Value: 0; Value_Code: 0000; Tolerance_%: 5; Power_W: 0.063; Value2: 0.063W; VDC_V: 50; TempCo: 200 ppm/C; EIA_Code: E24; U/M: EA; SymbolVersion: 2009-05-29; PartNumber: CRCW04020000Z0ED; PackageReference: 0402; RoHS: Y; Res_ohm: 0; Value1: 5%; MountType: SMT; Technology: Thick Film; Published: 2008-06-26; Publisher: Texas Instruments; LatestRevisionDate: 2015-06-17; ComponentLink1Description: Datasheet link; ComponentLink1URL: http://www.vishay.com/docs/20035/dcrcwe3.pdf; Supplier 1: Digi-Key; Supplier Part Number 1: 541-0.0JCT-ND; Supplier 2: Mouser; Supplier Part Number 2: 71-CRCW0402-0-E3; Supplier 3: Farnell; Supplier Part Number 3: 1469661
R20 = CRCW040212R1FKED: RES, 12.1, 1%, 0.063 W, 0402; Manufacturer: Vishay-Dale; CompType: Resistor; Value: 12.1; Value_Code: 12R1; Tolerance_%: 1; Power_W: 0.063; Value2: 0.063W; VDC_V: 50; TempCo: 100 ppm/C; EIA_Code: E96; U/M: EA; SymbolVersion: 2009-05-29; PartNumber: CRCW040212R1FKED; PackageReference: 0402; RoHS: Y; Res_ohm: 12.1; Value1: 1%; MountType: SMT; Technology: Thick Film; Published: 2008-06-26; Publisher: Texas Instruments; LatestRevisionDate: 2015-06-17; ComponentLink1Description: Datasheet link; ComponentLink1URL: http://www.vishay.com/docs/20035/dcrcwe3.pdf; Supplier 1: Digi-Key; Supplier Part Number 1: 541-12.1LCT-ND; Supplier 2: Mouser; Supplier Part Number 2: 71-CRCW0402-12.1-E3; Supplier 3: Farnell; Supplier Part Number 3: 1150810
R23 = ERJ-2RKF1004X: RES, 1.00 M, 1%, 0.1 W, 0402; Manufacturer: Panasonic; CompType: Resistor; Value: 1.00Meg; Res_ohm: 1000000; Value_Code: 1M00; Tolerance_%: 1; Power_W: 0.1; Value2: 0.1W; VDC_V: 50; TempCo: 100 ppm/C; EIA_Code: E96; U/M: EA; SymbolVersion: 2009-05-29; PartNumber: ERJ-2RKF1004X; PackageReference: 0402; RoHS: Y; Value1: 1%; MountType: SMT; Technology: Thick Film; Published: 2008-06-26; Publisher: Texas Instruments; LatestRevisionDate: 2015-06-17; ComponentLink1Description: Datasheet link; ComponentLink1URL: http://industrial.panasonic.com/www-data/pdf/AOA0000/AOA0000CE2.pdf; Supplier 1: Digi-Key; Supplier Part Number 1: P1.00MLCT-ND; Supplier 2: Mouser; Supplier Part Number 2: 667-ERJ-2RKF1004X; Supplier 3: Farnell; Supplier Part Number 3: 2304462
R26 = CRCW040216K9FKED: RES, 16.9 k, 1%, 0.063 W, 0402; Manufacturer: Vishay-Dale; CompType: Resistor; Value: 16.9k; Res_ohm: 16900; Value_Code: 16k9; Tolerance_%: 1; Power_W: 0.063; Value2: 0.063W; VDC_V: 50; TempCo: 100 ppm/C; SizeArea_mm2: 0.5; SizeZ_mm: 0.6; EIA_Code: E96; U/M: EA; AEC Category: Q200; SymbolVersion: 2009-05-29; PartNumber: CRCW040216K9FKED; PackageReference: 0402; RoHS: Y; Value1: 1%; MountType: SMT; Technology: Thick Film; SizeX_mm: 1; SizeY_mm: 0.5; Published: 2008-06-26; Publisher: Texas Instruments; LatestRevisionDate: 2017-06-12; ComponentLink1Description: Datasheet link; ComponentLink1URL: http://www.vishay.com/docs/20035/dcrcwe3.pdf; Supplier 1: Digi-Key; Supplier Part Number 1: 541-16.9KLCT-ND; Supplier 2: Newark; Supplier Part Number 2: 52K6732; Supplier 3: Mouser; Supplier Part Number 3: 71-CRCW0402-16.9K-E3; AEC Qualified: ?
R28 R30 R32 R40 = CRCW06033R30JNEA: RES, 3.3, 5%, 0.1 W, 0603; Manufacturer: Vishay-Dale; CompType: Resistor; Value: 3.3; Value_Code: 3R30; Tolerance_%: 5; Power_W: 0.1; Value2: 0.1W; VDC_V: 75; TempCo: 200 ppm/C; EIA_Code: E24; U/M: EA; SymbolVersion: 2009-05-29; PartNumber: CRCW06033R30JNEA; PackageReference: 0603; RoHS: Y; Res_ohm: 3.3; Value1: 5%; MountType: SMT; Technology: Thick Film; Published: 2008-06-26; Publisher: Texas Instruments; LatestRevisionDate: 2014-10-21; ComponentLink1Description: Datasheet link; ComponentLink1URL: http://www.vishay.com/docs/20035/dcrcwe3.pdf; Supplier 1: Digi-Key; Supplier Part Number 1: 541-3.3GCT-ND; Supplier 2: Mouser; Supplier Part Number 2: 71-CRCW0603J-3.3-E3; Supplier 3: Farnell; Supplier Part Number 3: 1514753
R31 = RC0603FR-07499KL: RES, 499 k, 1%, 0.1 W, 0603; Manufacturer: Yageo America; CompType: Resistor; Value: 499k; Res_ohm: 499000; Tolerance_%: 1; Power_W: 0.1; Value2: 0.1W; VDC_V: 150; TempCo: 200 ppm/C; EIA_Code: E96; U/M: EA; AEC Category: Q200; SymbolVersion: 2009-05-29; PartNumber: RC0603FR-07499KL; PackageReference: 0603; RoHS: Y; Value_Code: 499k; Value1: 1%; MountType: SMT; Technology: Thick Film; Published: 2008-06-26; Publisher: Texas Instruments; LatestRevisionDate: 2016-02-27; ComponentLink1Description: Datasheet link; ComponentLink1URL: http://www.yageo.com/pdf/Pu-RC0603_51_PbFree_L_2.pdf; Supplier 1: Digi-Key; Supplier Part Number 1: 311-499KHRCT-ND; Supplier 2: Mouser; Supplier Part Number 2: 603-RC0603FR-07499KL; Supplier 3: Farnell; Supplier Part Number 3: 1799347; AEC Qualified: ?
R33 = ERJ-2GE0R00X: RES, 0, 5%, 0.063 W, 0402; Manufacturer: Panasonic; CompType: Resistor; Value: 0; Value_Code: 0000; Tolerance_%: 5; Power_W: 0.063; Value2: 0.063W; VDC_V: 50; TempCo: 600 ppm/C; SizeArea_mm2: 0.5; SizeX_mm: 1; SizeZ_mm: 0.6; EIA_Code: E24; U/M: EA; AEC Category: Q200; Green_Lifecycle: Active; Green_REACh: Passed; SymbolVersion: 2009-05-29; PartNumber: ERJ-2GE0R00X; PackageReference: 0402; RoHS: Y; Res_ohm: 0; Value1: 5%; MountType: SMT; Technology: Thick Film; SizeY_mm: 0.5; Published: 2008-06-26; Publisher: Texas Instruments; LatestRevisionDate: 2017-06-12; ComponentLink1Description: Datasheet link; ComponentLink1URL: http://www.panasonic.com/industrial/components/pdf/AOA0000CE1.pdf; Supplier 1: Digi-Key; Supplier Part Number 1: P0.0JCT-ND; Supplier 2: Newark; Supplier Part Number 2: 65T8307; Supplier 3: Mouser; Supplier Part Number 3: 667-ERJ-2GE0R00X; AEC Qualified: ?; Green_EU RoHS: Passed with Exemption; Green_EU RoHS-2: Passed
R34 R38 R39 R41 R46 = RC0603FR-07100KL: RES, 100k ohm, 1%, 0.1W, 0603; Manufacturer: Yageo America; CompType: Resistor; Res_ohm: 100000; Tolerance_%: 1; Power_W: 0.1; VDC_V: 150; TempCo: 200 ppm/C; EIA_Code: E96; U/M: EA; SymbolVersion: 2009-05-29; PartNumber: RC0603FR-07100KL; PackageReference: 0603; RoHS: Y; Value_Code: 100k; Value1: 1%; Value2: 0.1W; MountType: SMT; Technology: Thick Film; Published: 2008-06-26; Publisher: Texas Instruments; LatestRevisionDate: 2014-05-20; ComponentLink1Description: Datasheet link; ComponentLink1URL: http://www.yageo.com/pdf/Pu-RC0603_51_PbFree_L_2.pdf; Supplier 1: Digi-Key; Supplier Part Number 1: 311-100KHRCT-ND; Supplier 2: Mouser; Supplier Part Number 2: 603-RC0603FR-07100KL; Supplier 3: Farnell; Supplier Part Number 3: 9238727
R35 = CRCW040220K5FKED: RES, 20.5 k, 1%, 0.063 W, 0402; Manufacturer: Vishay-Dale; CompType: Resistor; Value: 20.5k; Res_ohm: 20500; Value_Code: 20k5; Tolerance_%: 1; Power_W: 0.063; Value2: 0.063W; VDC_V: 50; TempCo: 100 ppm/C; SizeArea_mm2: 0.5; SizeZ_mm: 0.6; EIA_Code: E96; U/M: EA; AEC Category: Q200; SymbolVersion: 2009-05-29; PartNumber: CRCW040220K5FKED; PackageReference: 0402; RoHS: Y; Value1: 1%; MountType: SMT; Technology: Thick Film; SizeX_mm: 1; SizeY_mm: 0.5; Published: 2008-06-26; Publisher: Texas Instruments; LatestRevisionDate: 2017-04-13; ComponentLink1Description: Datasheet link; ComponentLink1URL: http://www.vishay.com/docs/20035/dcrcwe3.pdf; Supplier 1: Digi-Key; Supplier Part Number 1: 541-20.5KLCT-ND; Supplier 2: Newark; Supplier Part Number 2: 52K6819; Supplier 3: Mouser; Supplier Part Number 3: 71-CRCW0402-20.5K-E3; AEC Qualified: ?
R36 = CRCW040239K0JNED: RES, 39 k, 5%, 0.063 W, 0402; Manufacturer: Vishay-Dale; CompType: Resistor; Value: 39k; Res_ohm: 39000; Value_Code: 39k0; Tolerance_%: 5; Power_W: 0.063; Value2: 0.063W; VDC_V: 50; TempCo: 200 ppm/C; SizeArea_mm2: 0.5; SizeX_mm: 1; SizeZ_mm: 0.6; EIA_Code: E24; U/M: EA; AEC Category: Q200; SymbolVersion: 2009-05-29; PartNumber: CRCW040239K0JNED; PackageReference: 0402; RoHS: Y; Value1: 5%; MountType: SMT; Technology: Thick Film; SizeY_mm: 0.5; Published: 2008-06-26; Publisher: Texas Instruments; LatestRevisionDate: 2017-06-12; ComponentLink1Description: Datasheet link; ComponentLink1URL: http://www.vishay.com/docs/20035/dcrcwe3.pdf; Supplier 1: Digi-Key; Supplier Part Number 1: 541-39KJCT-ND; Supplier 2: Newark; Supplier Part Number 2: 59M6729; Supplier 3: Mouser; Supplier Part Number 3: 71-CRCW0402J-39K-E3; AEC Qualified: ?
R37 = RG1608P-472-B-T5: RES, 4.70 k, 0.1%, 0.1 W, 0603; Manufacturer: Susumu Co Ltd; CompType: Resistor; Value: 4.70k; Res_ohm: 4700; Value_Code: 4k70; Tolerance_%: 0.1; Value2: 0.1W; VDC_V: 75; TempCo: 25 ppm/C; EIA_Code: E192; U/M: EA; AEC Category: Q200; SymbolVersion: 2009-05-29; PartNumber: RG1608P-472-B-T5; PackageReference: 0603; RoHS: Y; Value1: 0.1%; Power_W: 0.1; MountType: SMT; Technology: Metal Film; Published: 2008-06-26; Publisher: Texas Instruments; LatestRevisionDate: 2015-12-05; ComponentLink1Description: Datasheet link; ComponentLink1URL: http://www.susumu.co.jp/english/pdf/products-j01-01.pdf; Supplier 1: Digi-Key; Supplier Part Number 1: RG16P4.7KBCT-ND; Supplier 2: Mouser; Supplier Part Number 2: 754-RG1608P-472-B-T5; Supplier 3: Farnell; Supplier Part Number 3: 1797194; AEC Qualified: ?
R42-R45 = CRCW080510R0JNEA: RES, 10, 5%, 0.125 W, 0805; Manufacturer: Vishay-Dale; CompType: Resistor; Value: 10; Value_Code: 10R0; Tolerance_%: 5; Power_W: 0.125; Value2: 0.125W; VDC_V: 150; TempCo: 200 ppm/C; EIA_Code: E24; U/M: EA; SymbolVersion: 2009-05-29; PartNumber: CRCW080510R0JNEA; PackageReference: 0805; RoHS: Y; Res_ohm: 10; Value1: 5%; MountType: SMT; Technology: Thick Film; Published: 2008-06-26; Publisher: Texas Instruments; LatestRevisionDate: 2014-12-17; ComponentLink1Description: Datasheet link; ComponentLink1URL: http://www.vishay.com/docs/20035/dcrcwe3.pdf; Supplier 1: Digi-Key; Supplier Part Number 1: 541-10ACT-ND; Supplier 2: Mouser; Supplier Part Number 2: 71-CRCW080510R0JNEA; Supplier 3: Farnell; Supplier Part Number 3: 1514808; ClassName: Full Flood
Rg1 Rg2 = CRCW04020000Z0ED: RES, 0, 5%, 0.063 W, 0402; Manufacturer: Vishay-Dale; CompType: Resistor; Value: 0; Value_Code: 0000; Tolerance_%: 5; Power_W: 0.063; Value2: 0.063W; VDC_V: 50; TempCo: 200 ppm/C; SizeArea_mm2: 0.5; SizeX_mm: 1; SizeZ_mm: 0.6; EIA_Code: E24; U/M: EA; AEC Category: Q200; Green_Lifecycle: Active; Green_REACh: Passed; SymbolVersion: 2009-05-29; PartNumber: CRCW04020000Z0ED; PackageReference: 0402; RoHS: Y; Res_ohm: 0; Value1: 5%; MountType: SMT; Technology: Thick Film; SizeY_mm: 0.5; Published: 2008-06-26; Publisher: Texas Instruments; LatestRevisionDate: 2017-06-12; ComponentLink1Description: Datasheet link; ComponentLink1URL: http://www.vishay.com/docs/20035/dcrcwe3.pdf; Supplier 1: Digi-Key; Supplier Part Number 1: 541-0.0JCT-ND; Supplier 2: Newark; Supplier Part Number 2: 52K6543; Supplier 3: Mouser; Supplier Part Number 3: 71-CRCW0402-0-E3; AEC Qualified: ?; Green_EU RoHS: Passed with Exemption; Green_EU RoHS-2: Passed
TP1-TP5 = 5003: Test Point, Miniature, Orange, TH; Manufacturer: Keystone; CompType: Test Point Loop; U/M: EA; SymbolVersion: 2008-04-04; PartNumber: 5003; PackageReference: Orange Miniature Testpoint; RoHS: Y; MountType: TH; ComponentLink1Description: Datasheet Link; ComponentLink1URL: http://www.keyelco.com/userAssets/file/M60-2p60.pdf; Value: Orange; Publisher: Texas Instruments; LatestRevisionDate: 2015-08-25; Supplier 1: Digi-Key; Supplier Part Number 1: 36-5003-ND